# Altium schematic sheet CE842170260_SHEET4.SchDoc
size Tabloid; SheetNumber: 4; SheetTotal: 4; PageSetup: Record=PageOptions|CenterHorizontal=True|CenterVertical=True|PrintScale=0.70|XCorrection=1.00|YCorrection=1.00|PrintKind=1|BorderSize=5000000|LeftOffset=0|BottomOffset=0|Orientation=2|PaperLength=1000|PaperWidth=1000|Scale=100|PaperSource=7|PrintQuality=-4|MediaType=1|DitherType=10|PaperKind=8 1/2x11|PrintScaleMode=1; SPICEModelCacheMIYJXAQF: <root> / <DocumentId>MIYJXAQF</DocumentId> / </root>
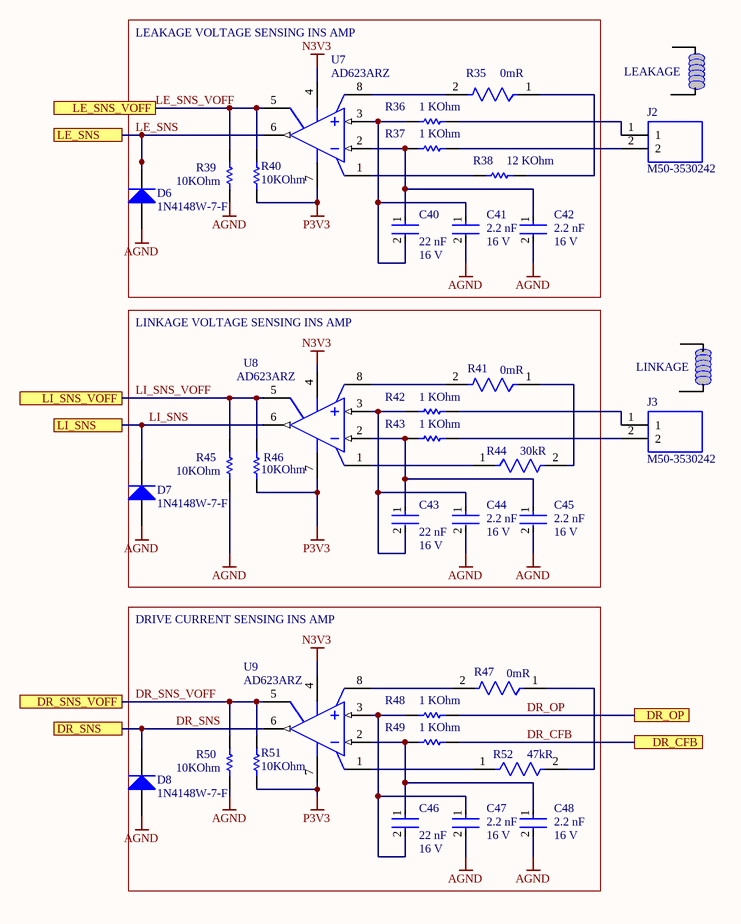
[diagram p0: CE842170260_SHEET4.SchDoc]

## Parts
C40  Voltage Rating: 16 V  Capacitance: 22 nF  [FP-CC0402-MFG]  (hidden comment: CC0402KRX7R7BB223)
C41  Capacitance: 2.2 nF  Voltage Rating: 16 V  [FP-CC0402-MFG]  (hidden comment: CC0402KRX7R7BB222)
C42  Capacitance: 2.2 nF  Voltage Rating: 16 V  [FP-CC0402-MFG]  (hidden comment: CC0402KRX7R7BB222)
C43  Voltage Rating: 16 V  Capacitance: 22 nF  [FP-CC0402-MFG]  (hidden comment: CC0402KRX7R7BB223)
C44  Capacitance: 2.2 nF  Voltage Rating: 16 V  [FP-CC0402-MFG]  (hidden comment: CC0402KRX7R7BB222)
C45  Capacitance: 2.2 nF  Voltage Rating: 16 V  [FP-CC0402-MFG]  (hidden comment: CC0402KRX7R7BB222)
C46  Voltage Rating: 16 V  Capacitance: 22 nF  [FP-CC0402-MFG]  (hidden comment: CC0402KRX7R7BB223)
C47  Capacitance: 2.2 nF  Voltage Rating: 16 V  [FP-CC0402-MFG]  (hidden comment: CC0402KRX7R7BB222)
C48  Capacitance: 2.2 nF  Voltage Rating: 16 V  [FP-CC0402-MFG]  (hidden comment: CC0402KRX7R7BB222)
D6  1N4148W-7-F  [DIOD-SOD123-2_V]
D7  1N4148W-7-F  [DIOD-SOD123-2_V]
D8  1N4148W-7-F  [DIOD-SOD123-2_V]
J2  M50-3530242  [HDRV2W40P0X127_1X2_254X210X420P]
J3  M50-3530242  [HDRV2W40P0X127_1X2_254X210X420P]
R35  Resistance: 0mR  [FP-MCS0402-MFG]  (hidden comment: MCS04020Z0000ZE000)
R36  Resistance: 1 KOhm  [RESC1005X40X25NL05T05]  (hidden comment: ERJ-2RKF1001X)
R37  Resistance: 1 KOhm  [RESC1005X40X25NL05T05]  (hidden comment: ERJ-2RKF1001X)
R38  Resistance: 12 KOhm  [RESC1005X40X25ML05T05]  (hidden comment: ERJ-2RKF1202X)
R39  Resistance: 10KOhm  [RESC1005X40X25LL05T05]  (hidden comment: ERJ2RKF1002X)
R40  Resistance: 10KOhm  [RESC1005X40X25LL05T05]  (hidden comment: ERJ2RKF1002X)
R41  Resistance: 0mR  [FP-MCS0402-MFG]  (hidden comment: MCS04020Z0000ZE000)
R42  Resistance: 1 KOhm  [RESC1005X40X25NL05T05]  (hidden comment: ERJ-2RKF1001X)
R43  Resistance: 1 KOhm  [RESC1005X40X25NL05T05]  (hidden comment: ERJ-2RKF1001X)
R44  Resistance: 30kR  [FP-ERJ2RK-IPC_C]  (hidden comment: ERJ-2RKF3002X)
R45  Resistance: 10KOhm  [RESC1005X40X25LL05T05]  (hidden comment: ERJ2RKF1002X)
R46  Resistance: 10KOhm  [RESC1005X40X25LL05T05]  (hidden comment: ERJ2RKF1002X)
R47  Resistance: 0mR  [FP-MCS0402-MFG]  (hidden comment: MCS04020Z0000ZE000)
R48  Resistance: 1 KOhm  [RESC1005X40X25NL05T05]  (hidden comment: ERJ-2RKF1001X)
R49  Resistance: 1 KOhm  [RESC1005X40X25NL05T05]  (hidden comment: ERJ-2RKF1001X)
R50  Resistance: 10KOhm  [RESC1005X40X25LL05T05]  (hidden comment: ERJ2RKF1002X)
R51  Resistance: 10KOhm  [RESC1005X40X25LL05T05]  (hidden comment: ERJ2RKF1002X)
R52  Resistance: 47kR  [FP-ERJ2RK-IPC_B]  (hidden comment: ERJ-2RKF4702X)
U7  AD623ARZ  [ADI-AD623ARZ-8_M]
U8  AD623ARZ  [ADI-AD623ARZ-8_M]
U9  AD623ARZ  [ADI-AD623ARZ-8_M]

## Blocks framed on the sheet
LEAKAGE VOLTAGE SENSING INS AMP: C40-C42 D6 R35-R40 U7
LINKAGE VOLTAGE SENSING INS AMP: C43-C45 D7 R41-R46 U8
DRIVE CURRENT SENSING INS AMP: C46-C48 D8 R47-R52 U9

## Ports
DR_CFB, DR_OP, DR_SNS, DR_SNS_VOFF, LE_SNS, LE_SNS_VOFF, LI_SNS, LI_SNS_VOFF

## Nets
AGND: C41.2 C42.2 C44.2 C45.2 C47.2 C48.2 D6.1(A) D7.1(A) D8.1(A) R39.1 R45.1 R50.1
N3V3: U7.4(-VS) U8.4(-VS) U9.4(-VS)
P3V3: R40.2 R46.2 R51.2 U7.7(+VS) U8.7(+VS) U9.7(+VS)
DR_CFB: R49.1 ; port DR_CFB
DR_OP: R48.1 ; port DR_OP
DR_SNS: D8.2(K) U9.6(OUTPUT) ; port DR_SNS
DR_SNS_VOFF: R50.2 R51.1 U9.5(REF) ; port DR_SNS_VOFF
LE_SNS: D6.2(K) U7.6(OUTPUT) ; port LE_SNS
LE_SNS_VOFF: R39.2 R40.1 U7.5(REF) ; port LE_SNS_VOFF
LI_SNS: D7.2(K) U8.6(OUTPUT) ; port LI_SNS
LI_SNS_VOFF: R45.2 R46.1 U8.5(REF) ; port LI_SNS_VOFF
NetC40_1: C40.1 C42.1 R37.2 U7.2(-IN)
NetC40_2: C40.2 C41.1 R36.2 U7.3(+IN)
NetC43_1: C43.1 C45.1 R43.2 U8.2(-IN)
NetC43_2: C43.2 C44.1 R42.2 U8.3(+IN)
NetC46_1: C46.1 C48.1 R49.2 U9.2(-IN)
NetC46_2: C46.2 C47.1 R48.2 U9.3(+IN)
NetJ2_1: J2.1 R36.1
NetJ2_2: J2.2 R37.1
NetJ3_1: J3.1 R42.1
NetJ3_2: J3.2 R43.1
NetR35_1: R35.1 R38.2
NetR35_2: R35.2 U7.8(+RG)
NetR38_1: R38.1 U7.1(-RG)
NetR41_1: R41.1 R44.2
NetR41_2: R41.2 U8.8(+RG)
NetR44_1: R44.1 U8.1(-RG)
NetR47_1: R47.1 R52.2
NetR47_2: R47.2 U9.8(+RG)
NetR52_1: R52.1 U9.1(-RG)

## Notes on the sheet
- LEAKAGE
- (near J3) LINKAGE
- BH CONFIDENTIAL
- NOTE
- Title:
- Sheet Title:
- Designed:
- Checked:
- Date:
- DRAWN IN ACCORDANCE WITH TECHNOLOGY WORK INSTRUCTIONS W064
- REV
- DATE
- ECR/ECN
- INT'L
- Number:
- Approved:
- FOR LIMITED NEED TO KNOW USE ONLY. NO PARTS OF THIS DOCUMENT MAY BE PRODUCED OR DISCLOSED WITHOUT PRIOR PERMISSION OF BH
- File:
- Sheet:
- of

## Library data of the parts
C40 C43 C46 = CMP-03422-001279-1: CAP CER 0.022UF 16V X7R 0402; Manufacturer: YAGEO; Temperature Coefficient: 30ppm/°C; Value: 22 nF; Automotive Grade: NA; Tolerance: 0.1; Material: Ceramic; RoHS: TRUE; Mouser Description: Multilayer Ceramic Capacitors MLCC - SMD/SMT 22nF 16V X7R 10%; Package: CC0402; Height: 0.55mm; Octopart: https://octopart.com/cc0402krx7r7bb223-yageo-42244626; ComponentLink2URL: http://www.yageo.com/documents/recent/UPY-GP_NP0_16V-to-50V_16.pdf; Lead Free: Yes; Temperature Characteristic: X7R; Ipc Land Pattern Name: CAPC10050X50; Temperature Range High: +125°C; Device Class L3: Ceramic Capacitors; Device Class L2: Capacitors; Device Class L1: Passive Components; ComponentLink2Description: Datasheet; Manufacturer Part Number: CC0402KRX7R7BB223; Automotive: No; Temperature Range Low: -55°C; Footprint Url: http://www.yageo.com/exep/pages/download/literatures/UPY-C_GEN_24.pdf; Category: Cap; Temperature: -55°C to +125°C; Digikey Description: CAP CER 0.022UF 16V X7R 0402
C41 C42 C44 C45 C47 C48 = CMP-03422-000450-1: CAP CER 2200PF 16V X7R 0402; Manufacturer: YAGEO; Value: 2.2 nF; Tolerance: 0.1; Material: Ceramic; Automotive Grade: NA; Temperature Coefficient: 30ppm/°C; Temperature Characteristic: X7R; Octopart: https://octopart.com/cc0402krx7r7bb222-yageo-12817657; Digikey Description: CAP CER 2200PF 16V X7R 0402; Temperature Range High: +125°C; Mouser Description: 0402 2.2 nF 16 V ±10 % Tolerance X7R SMT Multilayer Ceramic Capacitor; ComponentLink2URL: http://www.yageo.com/documents/recent/UPY-GP_NP0_16V-to-50V_16.pdf; Automotive: No; Device Class L3: Ceramic Capacitors; Footprint Url: http://www.yageo.com/exep/pages/download/literatures/UPY-C_GEN_24.pdf; ComponentLink2Description: Datasheet; Lead Free: Yes; Category: Cap; RoHS: TRUE; Temperature Range Low: -55°C; Height: 0.55mm; Manufacturer Part Number: CC0402KRX7R7BB222; Device Class L1: Passive Components; Temperature: -55°C to +125°C; Package: CC0402; Device Class L2: Capacitors; Ipc Land Pattern Name: CAPC10050X50
D6-D8 = CMP-2000-04932-2: Fast Switching Diode, 100 V, 0.15 A, -65 to 150 degC, 2-Pin?SOD123, RoHS, Tape and Reel; Recovery Time: 4ns; Brand: DiodesIncorporated; Unit Weight: 0.000353oz; Max Surge Current: 2A; Peak Reverse Voltage: 100V; Ir - Reverse Current: 1uA; Vf - Forward Voltage: 1.25V; Configuration: Single; If - Forward Current: 0.15A; Product Category: Diodes-GeneralPurpose,Power,Switching; Operating Temperature Range: -65Cto+150C; Packaging: Reel; Manufacturer URL: http://www.diodes.com/; Maximum Operating Temperature: +150C; Height: 1.25mm; Minimum Operating Temperature: -65C; Product: SwitchingDiodes; Package URL: http://www.diodes.com/datasheets/ds18004.pdf; Type: SwitchingDiode; Package Reference: SOD123-2; Width: 1.7mm; Datasheet URL: http://www.farnell.com/datasheets/1915529.pdf; Datasheet Version: Rev. 24-2, 10/2013; Series: 1N4148; Factory Pack Quantity: 3000; Length: 2.85mm; RoHS: True; Manufacturer: DiodesIncorporated; Mounting Style: SMD/SMT; Package / Case: SOD-123
J2 J3 = M50-3530242: Headers & Wire Housings 2 WAY SIL VERT PC TAIL P/HDR; Manufacturer_Name: Harwin; Geometry.Height: 4.2mm; Mouser Part Number: 855-M50-3530242; Mouser Price/Stock: https://www.mouser.co.uk/ProductDetail/Harwin/M50-3530242?qs=%252BdQmOuGyFcFfqfwYQe%2FxZw%3D%3D; Manufacturer_Part_Number: M50-3530242; Datasheet Link: https://cdn.harwin.com/pdfs/M50-353.pdf
R35 R41 R47 = CMP-02407-001042-1: RES SMD 1.2K OHM 1% 1/10W 0402; Voltage Rating: 50V; Max Power Dissipation: 100mW; Composition: Thin Film; Max Operating Temperature: 125°C; Number of Terminations: 2; Mount: Surface Mount; Packaging: Tape and Reel; REACH SVHC: No SVHC; Case Code (Metric): 1005; Package Quantity: 1; Radiation Hardening: No; Termination: Wraparound; Case Code (Imperial): 0402; Contact Plating: Tin; Depth: 0.5mm; Height: 0.015inch; Length: 1mm; Voltage Rating (DC): 50V; Power Rating: 100mW; Lead Free: Lead Free; Min Operating Temperature: -55°C; Military Standard: Not; Width: 0.02inch; Case/Package: 0402
R36 R37 R42 R43 R48 R49 = CMP-1011-00510-4: Chip Resistor, 1 KOhm, +/- 1%, 100 mW, -55 to 155 degC, 0402 (1005 Metric), RoHS, Tape and Reel; Manufacturer: Basic Passives; Voltage Rating: 50 V; Case\/Package: 0402; Power Rating: 100 mW; PartNumber: ERJ-2RKF1001X; DatasheetVersion: 04/2015; Radiation Hardening: No; Pins: 2; Height: 0.35 mm; RoHSCompliant: true; Case Code (Imperial): 0402; ComponentLink2Description: Datasheet; ComponentLink1Description: Manufacturer URL; PackageReference: 0402; Mount: Surface Mount; Package Quantity: 10000; Tolerance: 1%; ComponentLink1URL: http://www.panasonic.com/; PackageDescription: 2-Pin Surface Mount Device, Body 1 x 0.5 mm; Mounting Technology: Surface Mount; Case Code (Metric): 1005; ComponentLink2URL: http://industrial.panasonic.com/cdbs/www-data/pdf/RDA0000/AOA0000C86.pdf; REACH SVHC: Yes; Packaging: Tape and Reel; Max Operating Temperature: 155 degC; Min Operating Temperature: -55 degC; Width: 0.5 mm; Length: 1 mm
R38 = CMP-2002-00646-4: Chip Resistor, 12 KOhm, +/- 1%, 0.1 W, -55 to 155 degC, 0402 (1005 Metric), RoHS, Tape and Reel; Voltage Rating: 50 V; Case\/Package: 0402; Power Rating: 100 mW; Length: 1 mm; PackageReference: 0402; DatasheetVersion: 04/2015; ComponentLink2Description: Datasheet; ComponentLink1URL: http://www.panasonic.com/; Pins: 2; Width: 0.5 mm; REACH SVHC: Yes; Packaging: Tape and Reel; Min Operating Temperature: -55 degC; Mounting Technology: Surface Mount; Max Operating Temperature: 155 degC; Case Code (Imperial): 0402; Height: 0.35 mm; Tolerance: 1%; PackageDescription: 2-Pin Surface Mount Device, Body 1 x 0.5 mm; RoHSCompliant: true; ComponentLink1Description: Manufacturer URL; Mount: Surface Mount; ComponentLink2URL: http://industrial.panasonic.com/cdbs/www-data/pdf/RDA0000/AOA0000C86.pdf; Package Quantity: 10000; Case Code (Metric): 1005; PartNumber: ERJ-2RKF1202X
R39 R40 R45 R46 R50 R51 = CMP-2000-07588-1: Chip Resistor, 10 KOhm, +/- 1%, 0.1 W, -55 to 155 degC, 0402 (1005 Metric), RoHS, Tape and Reel; Manufacturer: Panasonic; Power Rating: 100mW; Voltage Rating: 50V; Case\/Package: 0402; Temperature Coefficient: 100ppm\/degreesC; RoHSCompliant: True; Lead Free: LeadFree; Package Quantity: 1; Contact Plating: Tin; Length: 1mm; Radiation Hardening: No; REACH SVHC: NoSVHC; Max Operating Temperature: 155degC; Depth: 0.5mm; Case Code (Imperial): 0402; Military Standard: Not; Package Description: 2-Pin Surface Mount Device, Body 1 x 0.5 mm; Termination: SMD/SMT; Case Code (Metric): 1005; Height: 0.35mm; Packaging: TapeandReel; Voltage Rating (DC): 50V; Package Reference: 402; Number of Pins: 2; Tolerance: 1%; Mounting Technology: SurfaceMount; Width: 0.02inch; Mount: SurfaceMount; Datasheet URL: https://industrial.panasonic.com/cdbs/www-data/pdf/RDA0000/AOA0000C304.pdf; Composition: ThickFilm; Datasheet Version: 02/2017; Manufacturer URL: http://www.panasonic.com/; Max Power Dissipation: 100mW; Number of Terminations: 2; Min Operating Temperature: -55degC
R44 = CMP-2002-01142-2: RES SMD 30K OHM 1% 1/10W 0402; Voltage Rating: 50V; Temperature Coefficient: 100ppm/°C; Power Rating: 100mW; Depth: 0.5mm; Tolerance: 1%; Length: 1mm; Contact Plating: Tin; Package Quantity: 10000; Resistance Tolerance: 1%; Min Operating Temperature: -55°C; Case/Package: 0402; Max Operating Temperature: 155°C; RoHS Compliant: Yes; Case Code (Imperial): 0402; Height: 0.35mm; Military Standard: Not; Technology: THICK FILM; Resistor Type: Thick Film; Termination: SMD/SMT; Voltage Rating (DC): 50V; Mount: Surface Mount; Series: ERJ; Number of Terminations: 2; Packaging: Tape and Reel; Construction: Rectangular; REACH SVHC: No SVHC; Case Code (Metric): 1005; Max Power Dissipation: 100mW; Width: 0.5mm
R52 = CMP-2002-01155-2: RES SMD 47K OHM 1% 1/10W 0402; Voltage Rating: 50V; Power Rating: 100mW; Temperature Coefficient: 100ppm/°C; Contact Plating: Tin; Radiation Hardening: No; Case/Package: 0402; Length: 1mm; Termination: SMD/SMT; RoHS Compliant: Yes; Resistor Type: Thick Film; Voltage Rating (DC): 50V; Depth: 0.5mm; Series: ERJ; Construction: Rectangular; REACH SVHC: No SVHC; Min Operating Temperature: -55°C; Packaging: Tape and Reel; Max Power Dissipation: 100mW; Military Standard: Not; Package Quantity: 1; Resistance Tolerance: 1%; Case Code (Metric): 1005; Technology: THICK FILM; Height: 0.35mm; Max Operating Temperature: 155°C; Number of Pins: 2; Tolerance: 1%; Case Code (Imperial): 0402; Width: 0.5mm; Number of Terminations: 2; Mount: Surface Mount; Features: Automotive AEC-Q200; Lead Free: Lead Free
U7-U9 = CMP-2000-05040-1: Single-Supply, Rail-to-Rail, Low Cost Instrumentation Amplifier, 800 KHz, -40 to 85 degC, 8-Pin SOIC, RoHS, Tube; Manufacturer: Analog Devices; EDA / CAD Models: DownloadfromAcceleratedDesigns; PCN Design/Specification: AD623PolymideThickness02/Oct/2013AD623PolymideThickness15/Oct/2013; -3db Bandwidth: 800kHz; Voltage - Supply, Single/Dual (±): 2.7V~12V,±2.5V~6V; Current - Input Bias: 17nA; Voltage - Input Offset: 25µV; Slew Rate: 0.3V/µs; Current - Supply: 375µA; Mfg Application Notes: Electrocardiogram(ECG)Solutions; Number of Circuits: 1; Product Training Modules: InstrumentationAmplifiersPerformanceCommonPhotodiodeOp-AmpCircuitProblemsandSolutionsIndirectCurrentFeedbackInstrumentationAmplifierApplicationsGuide; Manufacturer URL: http://www.analog.com/; Packaging: Tube; Mounting Type: SurfaceMount; Output Type: Rail-to-Rail; Gain Bandwidth Product: -; Datasheet URL: https://datasheet.ciiva.com/20167/82-1224-20167284.pdf; Current - Output / Channel: -; Standard Package: 98; Supplier Device Package: 8-SOIC; Amplifier Type: Instrumentation; Datasheet Version: Rev. D, 07/2008; Family: Linear-Amplifiers-Instrumentation,OPAmps,BufferAmps; Online Catalog: Instrumentation; Operating Temperature: -40degC~85degC; Category: IntegratedCircuits(ICs); Package / Case: 8-SOIC(0.154",3.90mmWidth); Series: -